# EAGLE schematic HW1_Brian Burton_u1038667 (EAGLE 9.6.2)
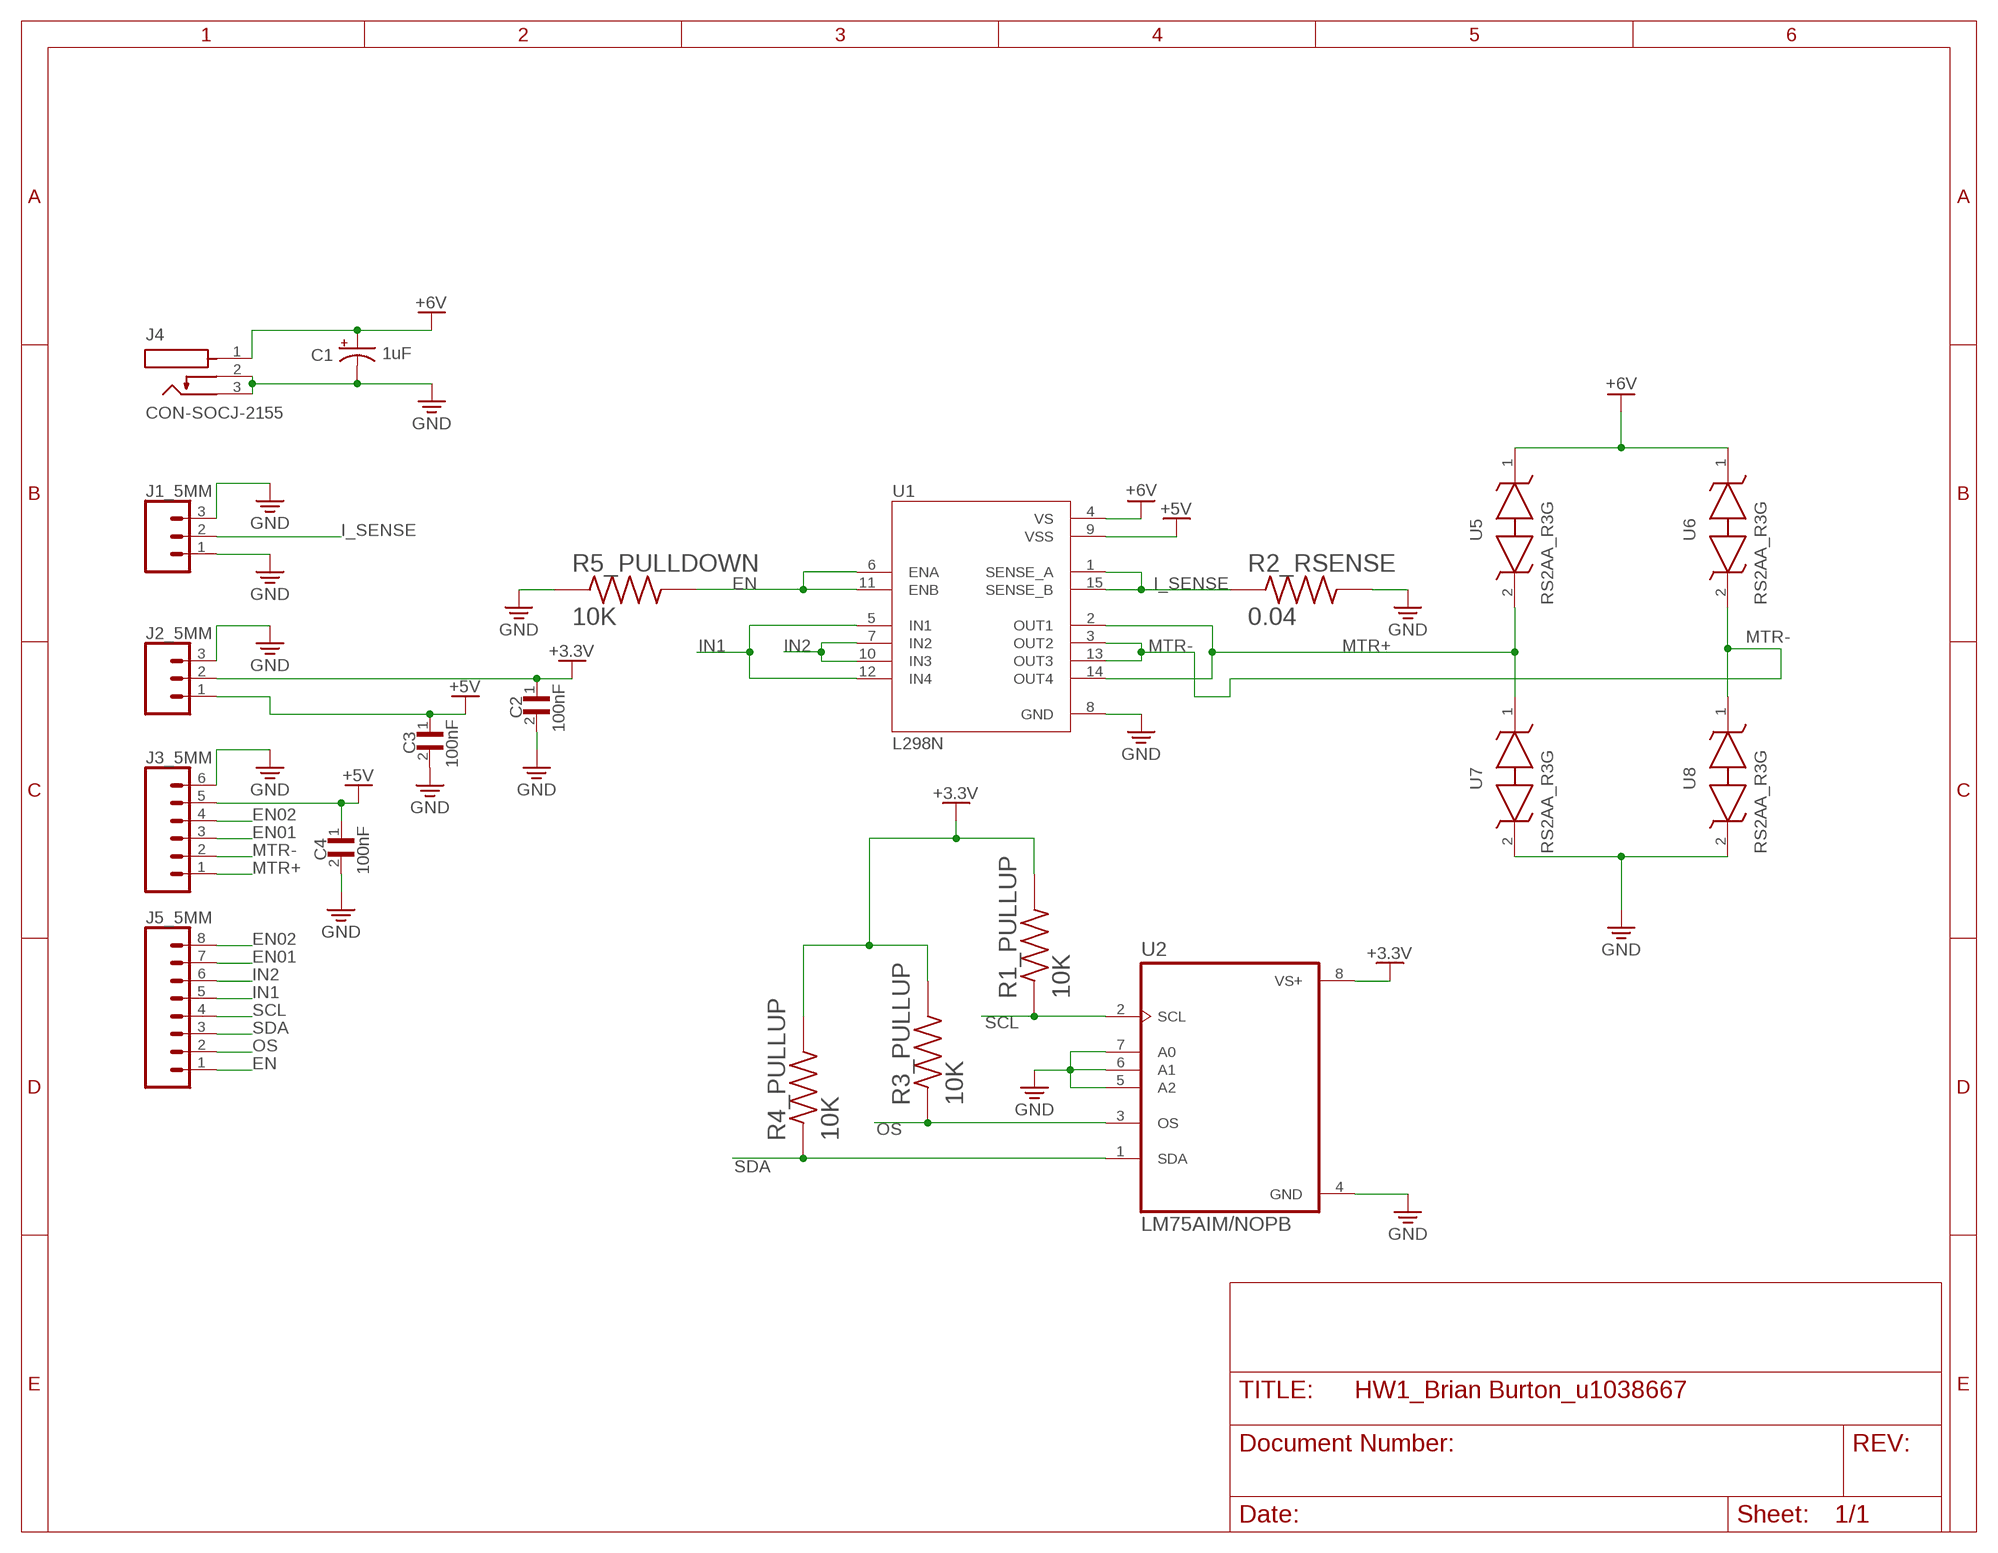
[diagram p0: schematic, sheet 1]

## Parts
C1  1uF  CPOL-USE3.5-8  [E3,5-8]
C2  100nF  C1206C104K5RAC7800  [CAPC3216X88N]
C3  100nF  C1206C104K5RAC7800  [CAPC3216X88N]
C4  100nF  C1206C104K5RAC7800  [CAPC3216X88N]
J1_5MM  CONN_03-SCREW-5MM  [SCREWTERMINAL-5MM-3]
J2_5MM  CONN_03-SCREW-5MM  [SCREWTERMINAL-5MM-3]
J3_5MM  CONN_06LOCK  [1X06_LOCK]
J4  CON-SOCJ-2155  [GRAVITECH_CON-SOCJ-2155]
J5_5MM  CONN_08"  [1X08]
R1_PULLUP  10K  RC1206JR-0710KL  [RESC3116X65N]
R2_RSENSE  0.04  RL1206FR-070R04L  [RESC3116X65N]
R3_PULLUP  10K  RC1206JR-0710KL  [RESC3116X65N]
R4_PULLUP  10K  RC1206JR-0710KL  [RESC3116X65N]
R5_PULLDOWN  10K  RC1206JR-0710KL  [RESC3116X65N]
U1  L298N  [TO127P2020X500X2100-15]
U2  LM75AIM/NOPB  [SOIC127P599X175-8N]
U5  RS2AA_R3G  [DIONM5126X250N]
U6  RS2AA_R3G  [DIONM5126X250N]
U7  RS2AA_R3G  [DIONM5126X250N]
U8  RS2AA_R3G  [DIONM5126X250N]

## Nets
+3.3V: C2.1 J2_5MM.2 R1_PULLUP.2 R3_PULLUP.2 R4_PULLUP.2 U2.8(VS+)
+6V: C1.+ C3.1 C4.1 J2_5MM.1 J3_5MM.5 J4.1 U1.9(VSS) ; supply symbol labelled +5V
+V: U1.4(VS) U5.1 U6.1 ; supply symbol labelled +6V
EN: J5_5MM.1 R5_PULLDOWN.2 U1.6(ENA) U1.11(ENB)
EN01: J3_5MM.3 J5_5MM.7
EN02: J3_5MM.4 J5_5MM.8
GND: C1.- C2.2 C3.2 C4.2 J1_5MM.1 J1_5MM.3 J2_5MM.3 J3_5MM.6 J4.2 J4.3 R2_RSENSE.2 R5_PULLDOWN.1 U1.8(GND) U2.4(GND) U2.5(A2) U2.6(A1) U2.7(A0) U7.2 U8.2
I_SENSE: J1_5MM.2 R2_RSENSE.1 U1.1(SENSE_A) U1.15(SENSE_B)
IN1: J5_5MM.5 U1.5(IN1) U1.12(IN4)
IN2: J5_5MM.6 U1.7(IN2) U1.10(IN3)
MTR+: J3_5MM.1 U1.2(OUT1) U1.14(OUT4) U5.2 U7.1
MTR-: J3_5MM.2 U1.3(OUT2) U1.13(OUT3) U6.2 U8.1
OS: J5_5MM.2 R3_PULLUP.1 U2.3(OS)
SCL: J5_5MM.4 R1_PULLUP.1 U2.2(SCL)
SDA: J5_5MM.3 R4_PULLUP.1 U2.1(SDA)

## Library data of the parts
C1 = rcl:CPOL-US: POLARIZED CAPACITOR, American symbol; SPICEPREFIX: C
C2-C4 = C1206C104K5RAC7800 (1):C1206C104K5RAC7800: Cap Ceramic 0.1uF 50V X7R 10% SMD 1206 125C Plastic T/R Check availability <https://pricing.snapeda.com/parts/C1206C104K5RAC7800/KEMET/view-part?ref=eda>; AVAILABILITY: In Stock; DESCRIPTION: 0.1 µF ±10% 50V Ceramic Capacitor X7R 1206 (3216 Metric); MF: KEMET; MP: C1206C104K5RAC7800; PACKAGE: 3216 KEMET; PRICE: None; PURCHASE-URL: https://pricing.snapeda.com/search/part/C1206C104K5RAC7800/?ref=eda
J1_5MM J2_5MM = SparkFun-Connectors:CONN_03: Multi connection point. Often used as Generic Header-pin footprint for 0.1 inch spaced/style header connections On any of the 0.1 inch spaced packages, you can populate with these: Break Away Headers - Straight <https://www.sparkfun.com/products/116> (PRT-00116) Break Away Male Headers - Right Angle <https://www.sparkfun.com/products/553> (PRT-00553) Female Headers <https://www.sparkfun.com/products/115> (PRT-00115) Break Away Headers - Machine Pin <https://www.sparkfun.com/products/117> (PRT-00117) Break Away Female Headers - Swiss Machine Pin <https://www.sparkfun.com/products/743> (PRT-00743) Stackable Header - 3 Pin (Female, 0.1") <https://www.sparkfun.com/products/13875> (PRT-13875) For SCREWTERMINALS and SPRING TERMINALS visit here: Screw Terimnals on SparkFun.com <https://www.sparkfun.com/search/results?term=Screw+Terminals> (5mm/3.5mm/2.54mm spacing) This device is also useful as a general connection point to wire up your design to another part of your project. Our various solder wires solder well into these plated through hole pads. Hook-Up Wire - Assortment (Stranded, 22 AWG) <https://www.sparkfun.com/products/11375> (PRT-11375) Hook-Up Wire - Assortment (Solid Core, 22 AWG) <https://www.sparkfun.com/products/11367> (PRT-11367) View the entire wire category on our website here <https://www.sparkfun.com/categories/141> Special notes: Molex polarized connector foot print use with SKU : PRT-08232 with associated crimp pins and housings.; PROD_ID: CONN-10134; SF_SKU: PRT-08433
J3_5MM = SparkFun-Connectors:CONN_06: Multi connection point. Often used as Generic Header-pin footprint for 0.1 inch spaced/style header connections On any of the 0.1 inch spaced packages, you can populate with these: Break Away Headers - Straight <https://www.sparkfun.com/products/116> (PRT-00116) Break Away Male Headers - Right Angle <https://www.sparkfun.com/products/553> (PRT-00553) Female Headers <https://www.sparkfun.com/products/115> (PRT-00115) Break Away Headers - Machine Pin <https://www.sparkfun.com/products/117> (PRT-00117) Break Away Female Headers - Swiss Machine Pin <https://www.sparkfun.com/products/743> (PRT-00743) Arduino Stackable Header - 6 Pin <https://www.sparkfun.com/products/9280> (PRT-09280) For SCREWTERMINALS and SPRING TERMINALS visit here: Screw Terimnals on SparkFun.com <https://www.sparkfun.com/search/results?term=Screw+Terminals> (5mm/3.5mm/2.54mm spacing) This device is also useful as a general connection point to wire up your design to another part of your project. Our various solder wires solder well into these plated through hole pads. Hook-Up Wire - Assortment (Stranded, 22 AWG) <https://www.sparkfun.com/products/11375> (PRT-11375) Hook-Up Wire - Assortment (Solid Core, 22 AWG) <https://www.sparkfun.com/products/11367> (PRT-11367) View the entire wire category on our website here <https://www.sparkfun.com/categories/141>
J4 = CON-SOCJ-2155 (1):CON-SOCJ-2155: DC Power Connectors Power Jack/Connector 2.1mm x 5.5mm Check availability <https://pricing.snapeda.com/parts/CON-SOCJ-2155/Gravitech/view-part?ref=eda>; AVAILABILITY: In Stock; DESCRIPTION: DC Power Connectors Power Jack/Connector 2.1mm x 5.5mm; MF: Gravitech; MP: CON-SOCJ-2155; PACKAGE: None; PRICE: None; PURCHASE-URL: https://pricing.snapeda.com/search/part/CON-SOCJ-2155/?ref=eda
J5_5MM = SparkFun-Connectors:CONN_08: Multi connection point. Often used as Generic Header-pin footprint for 0.1 inch spaced/style header connections On any of the 0.1 inch spaced packages, you can populate with these: Break Away Headers - Straight <https://www.sparkfun.com/products/116> (PRT-00116) Break Away Male Headers - Right Angle <https://www.sparkfun.com/products/553> (PRT-00553) Female Headers <https://www.sparkfun.com/products/115> (PRT-00115) Break Away Headers - Machine Pin <https://www.sparkfun.com/products/117> (PRT-00117) Break Away Female Headers - Swiss Machine Pin <https://www.sparkfun.com/products/743> (PRT-00743) Arduino Stackable Header - 8 Pin <https://www.sparkfun.com/products/9279> (PRT-09279) For SCREWTERMINALS and SPRING TERMINALS visit here: Screw Terimnals on SparkFun.com <https://www.sparkfun.com/search/results?term=Screw+Terminals> (5mm/3.5mm/2.54mm spacing) This device is also useful as a general connection point to wire up your design to another part of your project. Our various solder wires solder well into these plated through hole pads. Hook-Up Wire - Assortment (Stranded, 22 AWG) <https://www.sparkfun.com/products/11375> (PRT-11375) Hook-Up Wire - Assortment (Solid Core, 22 AWG) <https://www.sparkfun.com/products/11367> (PRT-11367) View the entire wire category on our website here <https://www.sparkfun.com/categories/141> Special notes: Molex polarized connector foot print use with SKU : PRT-08231 with associated crimp pins and housings. 1MM SMD Version SKU: PRT-10208 NOTES ON THE VARIANTS LOCK and LOCK_LONGPADS... This footprint was designed to help hold the alignment of a through-hole component (i.e. 6-pin header) while soldering it into place. You may notice that each hole has been shifted either up or down by 0.005 of an inch from it's more standard position (which is a perfectly straight line). This slight alteration caused the pins (the squares in the middle) to touch the edges of the holes. Because they are alternating, it causes a "brace" to hold the component in place. 0.005 has proven to be the perfect amount of "off-center" position when using our standard breakaway headers. Although looks a little odd when you look at the bare footprint, once you have a header in there, the alteration is very hard to notice. Also,if you push a header all the way into place, it is covered up entirely on the bottom side.; PROD_ID: CONN-08438
R1_PULLUP R3_PULLUP R4_PULLUP R5_PULLDOWN = RC1206JR-0710KL (1):RC1206JR-0710KL: Res Thick Film 1206 10K Ohm 5% 0.25W(1/4W) ±100ppm/C Epoxy Pad SMD T/R Check availability <https://pricing.snapeda.com/parts/RC1206JR-0710KL/Yageo/view-part?ref=eda>; AVAILABILITY: In Stock; DESCRIPTION: 10 kOhms ±5% 0.25W, 1/4W Chip Resistor 1206 (3216 Metric) Moisture Resistant Thick Film; MF: Yageo; MP: RC1206JR-0710KL; PACKAGE: 3116 Yageo; PRICE: None; PURCHASE-URL: https://pricing.snapeda.com/search/part/RC1206JR-0710KL/?ref=eda
R2_RSENSE = RL1206FR-070R04L (1):RL1206FR-070R04L: Check availability <https://pricing.snapeda.com/parts/RL1206FR-070R04L/Yageo/view-part?ref=eda>; AVAILABILITY: In Stock; DESCRIPTION: 40 mOhms ±1% 0.25W, 1/4W Chip Resistor 1206 (3216 Metric) Automotive AEC-Q200, Current Sense, Moisture Resistant Thick Film; MF: Yageo; MP: RL1206FR-070R04L; PACKAGE: 3116 Yageo; PRICE: None; PURCHASE-URL: https://pricing.snapeda.com/search/part/RL1206FR-070R04L/?ref=eda
U1 = L298N (1):L298N: Dual Full Bridge Motor Driver 15-Pin(15+Tab) MULTIWATT V Tube Check availability <https://pricing.snapeda.com/parts/L298N/STMicroelectronics/view-part?ref=eda>; AVAILABILITY: In Stock; DESCRIPTION: Half Bridge (4) Driver DC Motors, Relays, Solenoids, Stepper Motors Bipolar 15-Multiwatt; MF: STMicroelectronics; MP: L298N; PACKAGE: Multiwatt-15 Magnatec; PRICE: None; PURCHASE-URL: https://pricing.snapeda.com/search/part/L298N/?ref=eda
U2 = LM75AIM_NOPB:LM75AIM/NOPB; DESCRIPTION: IC, TEMP SENSOR, 2WIRE, 8SOIC; IC Output Type:Voltage; Sensing Accuracy Range:± 2°C; Sensing Temperature Min:-55°C; Sensing Temperature Max:+125°C; Supply Voltage Min:2.7V; Supply Voltage Max:5.5V; Sensor Case Style:SOIC; No. of Pins:8; Resolution (Bits):9bit; Supply Current:280µA; SVHC:No SVHC (20-Jun-2013); Base Number:75; Operating Temperature Max:125°C; Operating Temperature Min:-55°C; Operating Temperature Range:-55°C to +125°C; Output Current:4mA; Resolution:9bit; Sensor / Transducer Type:Temperature; Supply Voltage Range:2.7V to 5.5V; Temperature Sensing Range:-55°C to +125°C; Termination Type:SMD; DIGI-KEY_PART_NUMBER: LM75AIMME/NOPBTR-ND; MF: Texas Instruments; MP: LM75AIM; PACKAGE: SOIC-8 Texas Instruments; PURCHASE-URL: https://pricing.snapeda.com/search/part/LM75AIM/?ref=eda
U5-U8 = RS2AA_R3G (1):RS2AA_R3G: Rectifiers 150ns, 1.5A, 50V, Fast Recovery Rectifier Source: Datasheet <https://www.taiwansemi.com/products/datasheet/RS2AA SERIES_G14.pdf> Check availability <https://pricing.snapeda.com/parts/RS2AA%20R3G/Taiwan%20Semiconductor%20Corporation/view-part?ref=eda>; AVAILABILITY: In Stock; DESCRIPTION: Rectifier Diode Switching 50V 1.5A 150ns 2-Pin SMA T/R; MF: Taiwan Semiconductor Corporation; MP: RS2AA R3G; PACKAGE: None; PRICE: None